# EasyEDA Pro project ChargingManager.eprj

# Schematic Schematic1
Create Date: 2024-06-30; Page Name: P1; Project Name: ChargingManager; Schematic Name: Schematic1; Update Date: 2024-06-30; Company: 嘉立创EDA; Page Size: A4; Version: V1.0
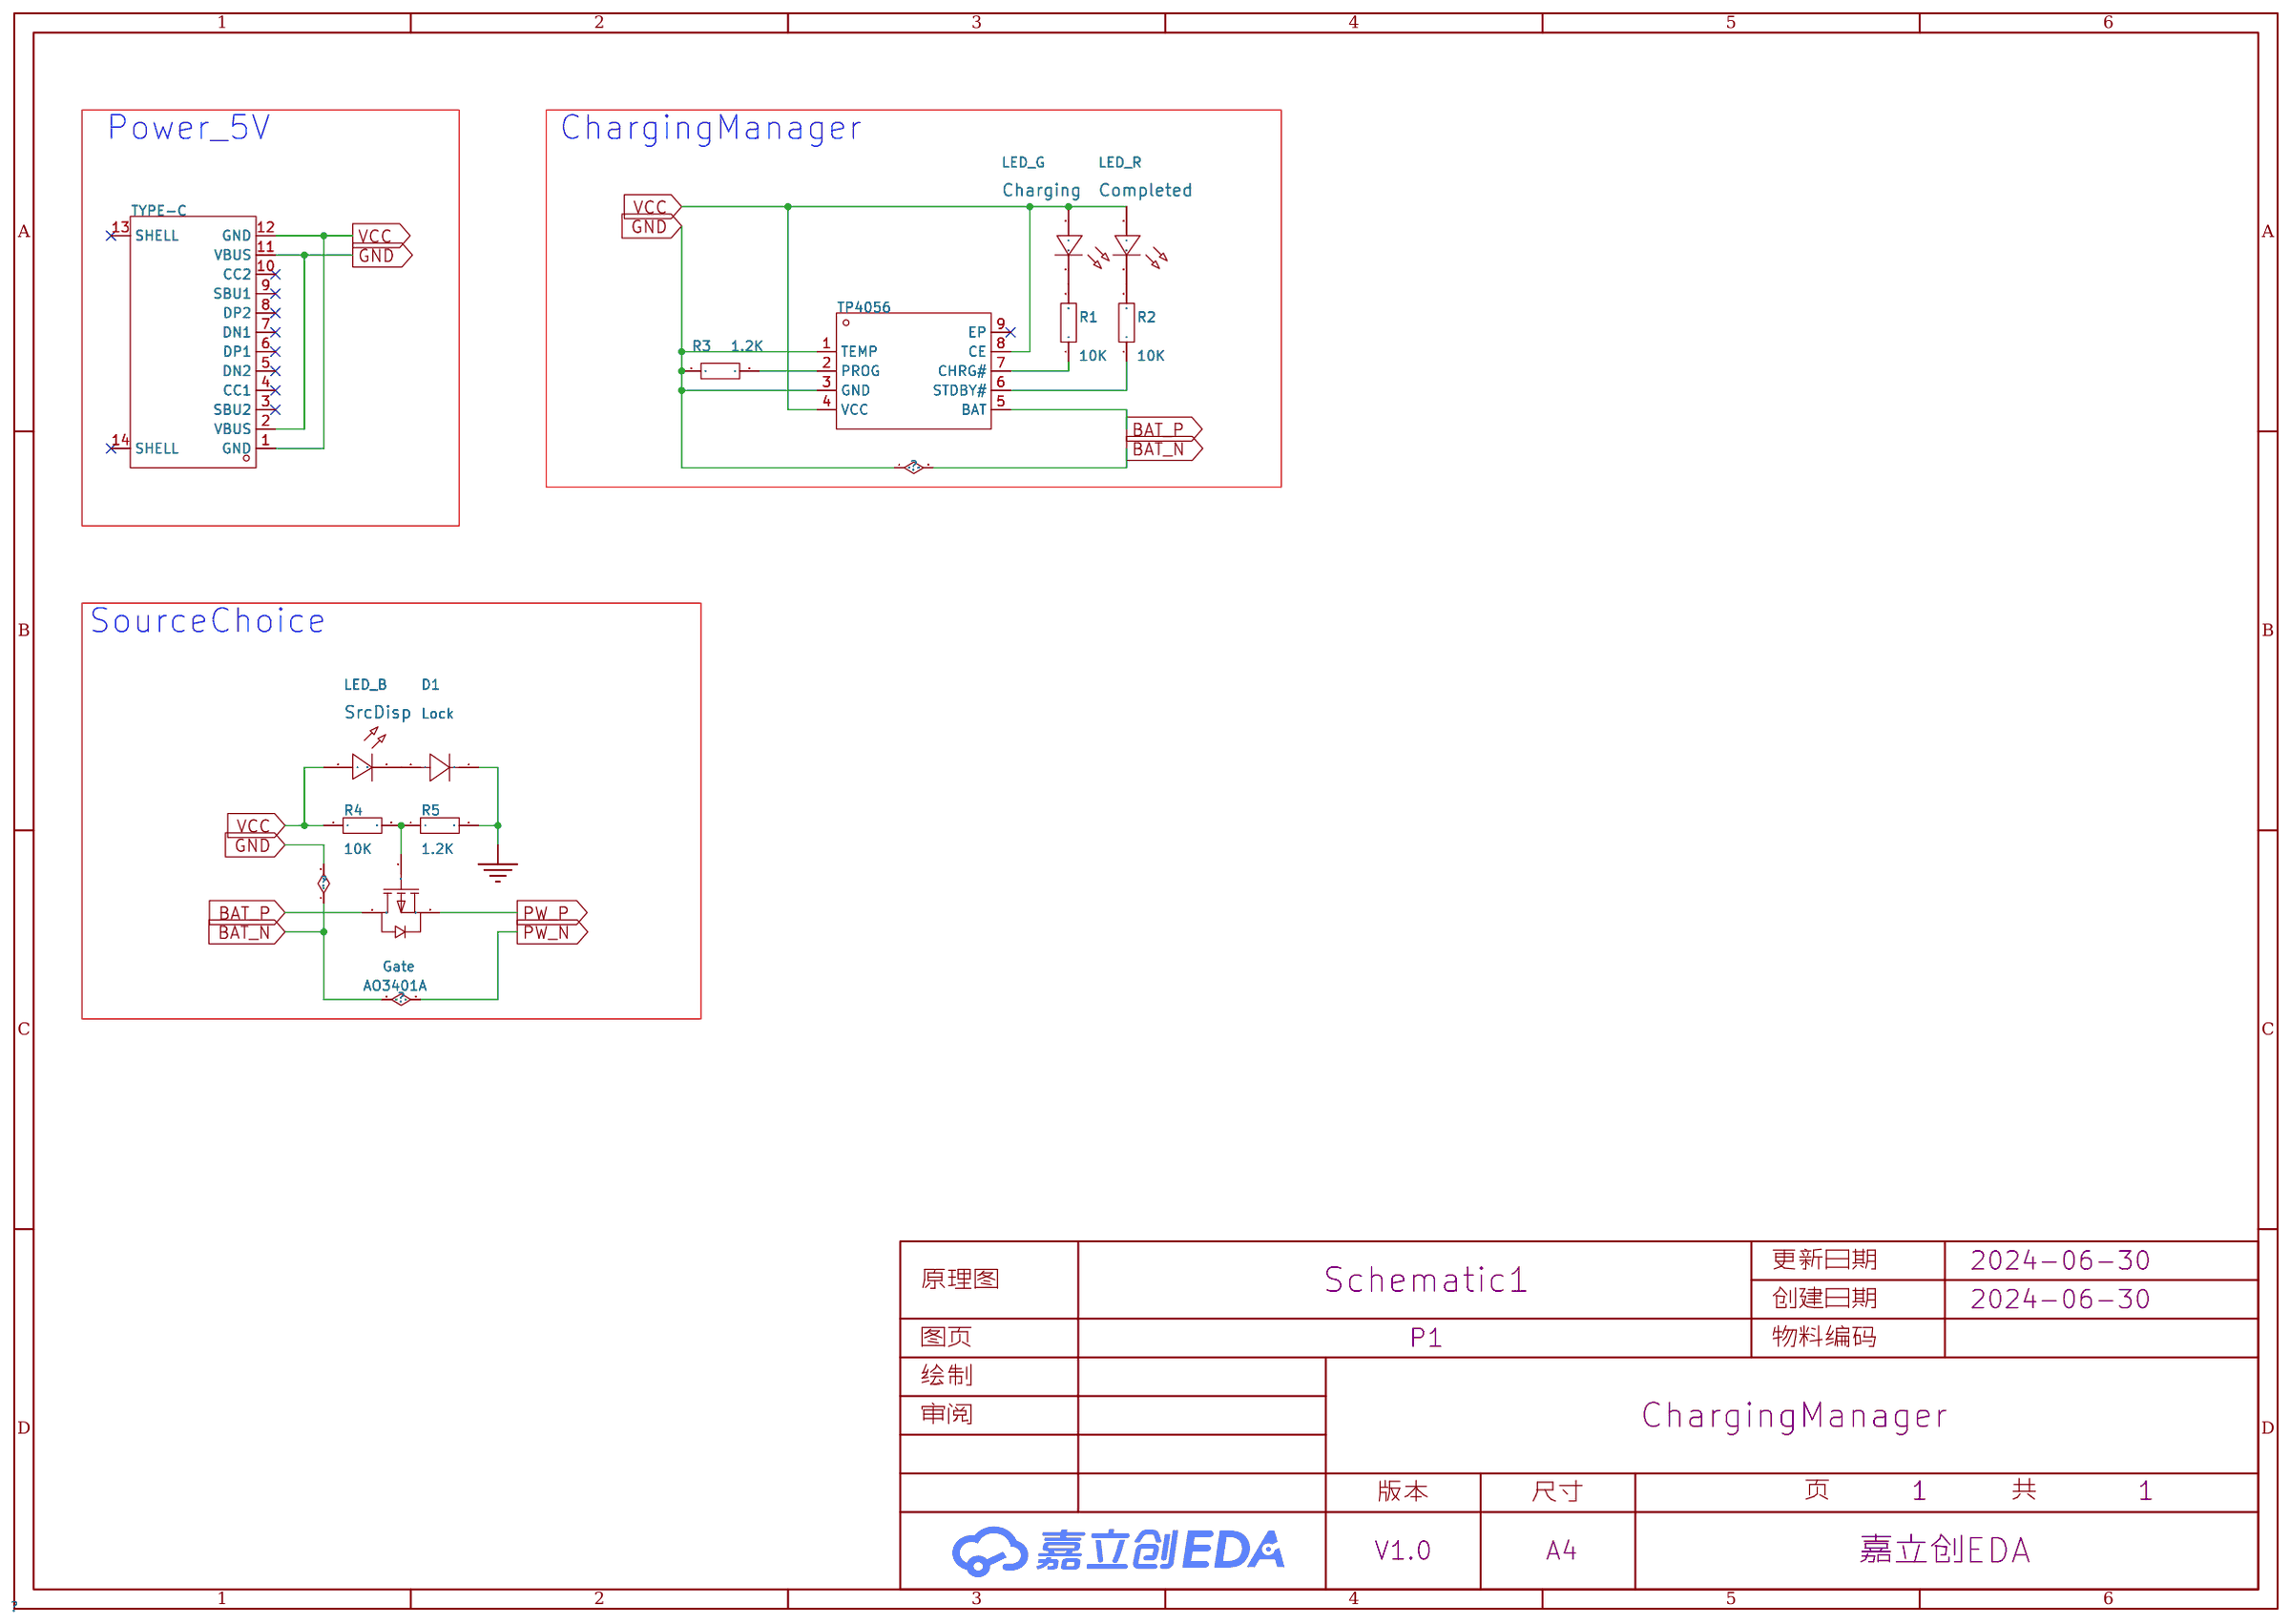
[diagram p0: schematic sheet]

## Parts
Charging  LED_G  [LED_0603]
Completed  LED_R  [LED_0603]
Gate  AO3401A  [SOT-23_L2.9-W1.3-P1.90-LS2.4-BR]
Lock  D1  [DO_1N4007]
R1  10K  [R0603]
R2  10K  [R0603]
R3  1.2K  [R0603]
R4  10K  [R0603]
R5  1.2K  [R0603]
SrcDisp  LED_B  [LED_0603]
Type-C  TYPE-C  [USB-C-SMD_TYPE-C-6PIN-2MD-073]
U1  TP4056  [ESOP-8_L4.9-W3.9-P1.27-LS6.0-BL-EP]

## Library data of the parts
Charging Completed SrcDisp = LED_0603-R: Supplier Footprint: 0603
Gate = AO3401A_C15127: 类型:1个P沟道;漏源电压(Vdss):30V;连续漏极电流(Id):4A;功率(Pd):1.4W;导通电阻(RDS(on)@Vgs,Id):44mΩ@10V,4.3A;阈值电压(Vgs(th)@Id):1.3V@250uA;; LCSC Part Name: 1个P沟道 耐压:30V 电流:4A; Supplier Part: C15127; Manufacturer: AOS; Supplier Footprint: SOT-23; Datasheet: https://atta.szlcsc.com/upload/public/pdf/source/20160507/1462613609053.pdf; Supplier: LCSC; Type: 1个P沟道; Drain Source Voltage (Vdss): 30V; Continuous Drain Current (Id): 4A; Power Dissipation (Pd): 1.4W; Drain Source On Resistance (RDS(on)@Vgs,Id): 44mΩ@10V,4.3A; Gate Threshold Voltage (Vgs(th)@Id): 1.3V@250uA; Total Gate Charge (Qg@Vgs): 12.2nC@4.5V; Input Capacitance (Ciss@Vds): 1.2nF@15V; Operating Temperature: -55℃~+150℃@(Tj)
Lock = D_1N4007A: Supplier Footprint: DO-41
R1-R5 = Res_0603: Supplier Footprint: 0603
Type-C = TYPE-C 16PIN 2MD(073): 连接器类型:Type-C;标准:-;公母:母;端口数量:1;触点数量:16P;安装方式:卧贴;额定电流 - 电源:5A;工作温度范围:-25℃~+85℃;; LCSC Part Name: Type-C 母 卧贴; Supplier Part: C2765186; Manufacturer: SHOU HAN(首韩); Supplier Footprint: SMD; Datasheet: https://atta.szlcsc.com/upload/public/pdf/source/20211123/39B17C16241EAC15C5E277BDA434118E.pdf; Supplier: LCSC; Gender: 母; Number of Ports: 1; Number of Contacts: 16P; Mounting Style: 卧贴; Current Rating - Power (Max): 5A; Operating Temperature Range: -25℃~+85℃
U1 = TP4056_C725790: Supplier Part: C725790; Manufacturer: UMW(友台半导体); Supplier Footprint: ESOP-8; Datasheet: https://atta.szlcsc.com/upload/public/pdf/source/20231109/CF74897CE79A500F7FE27A45ADCCC631.pdf; Supplier: LCSC

## Nets
GND: Lock.1(K) R3.1 R5.2 Type-C.2(VBUS) Type-C.11(VBUS) U1.1(TEMP) U1.3(GND)
VCC: Charging.2(A) Completed.2(A) R4.1 SrcDisp.2(A) Type-C.1(GND) Type-C.12(GND) U1.4(VCC) U1.8(CE)
BAT_P: Gate.3(D) U1.5(BAT)
PW_P: Gate.2(S)
Net-(Charging-1): Charging.1(C) R1.2
Net-(Completed-1): Completed.1(C) R2.2
Net-(Gate-1): Gate.1(G) R4.2 R5.1
Net-(Lock-2): Lock.2(A) SrcDisp.1(C)
Net-(R1-1): R1.1 U1.7(CHRG#)
Net-(R2-1): R2.1 U1.6(STDBY#)
Net-(R3-2): R3.2 U1.2(PROG)

Not connected (* = marked no-connect by the designer): Type-C 3(SBU2)* 4(CC1)* 5(DN2)* 6(DP1)* 7(DN1)* 8(DP2)* 9(SBU1)* 10(CC2)* 13(SHELL)* 14(SHELL)*; U1 9(EP)*

## Notes on the sheet
- Power_5V
- ChargingManager
- SourceChoice
